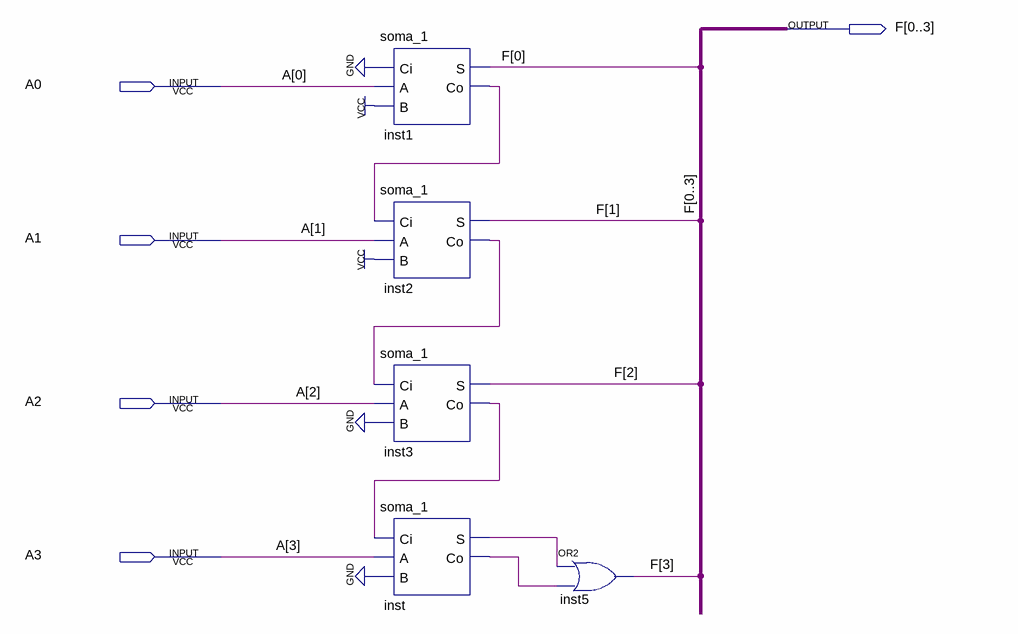
[diagram p0: schematic sheet]
// Quartus schematic somar3.bdf as structural Verilog: 5 symbols, 5 pins
module somar3 (
  input  A0,
  input  A1,
  input  A2,
  input  A3,
  output [0:3] F
);

  wire inst1_co, inst2_co, inst3_co, inst_co, inst_s;

  soma_1 inst1 (.Ci(1'b0), .A(A0), .B(1'b1), .S(F[0]), .Co(inst1_co));
  soma_1 inst2 (.Ci(inst1_co), .A(A1), .B(1'b1), .S(F[1]), .Co(inst2_co));
  soma_1 inst3 (.Ci(inst2_co), .A(A2), .B(1'b0), .S(F[2]), .Co(inst3_co));
  soma_1 inst (.Ci(inst3_co), .A(A3), .B(1'b0), .S(inst_s), .Co(inst_co));
  or inst5 (F[3], inst_s, inst_co);
endmodule
